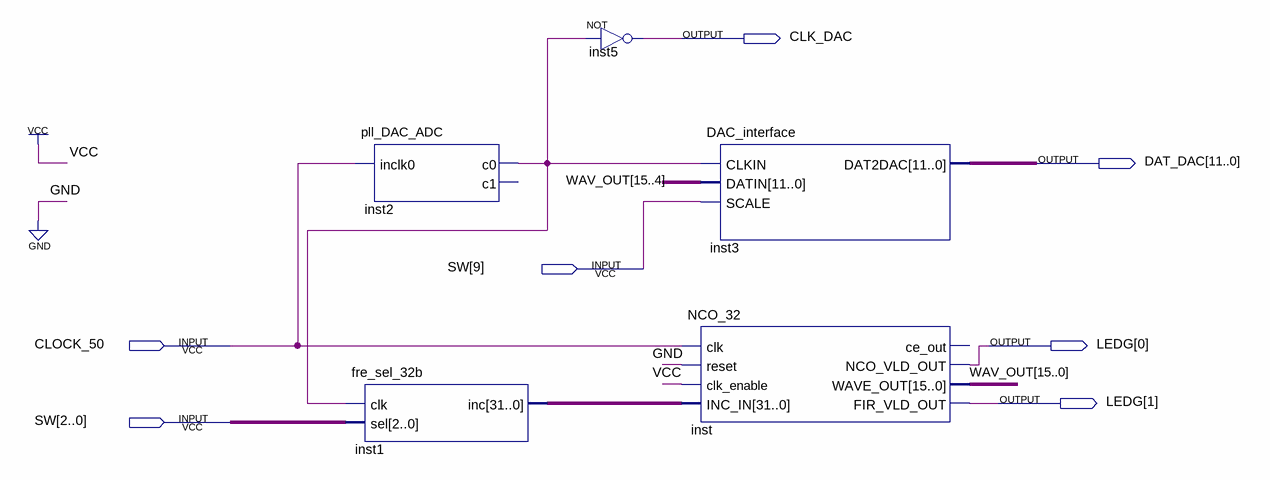
[diagram p0: schematic sheet]
// Quartus schematic NCO_32_quartus.bdf as structural Verilog: 5 symbols, 7 pins
module NCO_32_quartus (
  input  [9:0] SW,
  input  CLOCK_50,
  output CLK_DAC,
  output [11:0] DAT_DAC,
  output [1:0] LEDG
);

  wire inst2_c0;
  wire [15:0] WAV_OUT;
  wire [31:0] inst1_inc;

  pll_DAC_ADC inst2 (.inclk0(CLOCK_50), .c0(inst2_c0));  // open: c1
  fre_sel_32b inst1 (.clk(inst2_c0), .sel(SW[2:0]), .inc(inst1_inc));
  not inst5 (CLK_DAC, inst2_c0);
  DAC_interface inst3 (.CLKIN(inst2_c0), .DATIN(WAV_OUT[15:4]), .SCALE(SW[9]), .DAT2DAC(DAT_DAC));
  NCO_32 inst (
    .clk(CLOCK_50), .reset(1'b0), .clk_enable(1'b1), .INC_IN(inst1_inc), .NCO_VLD_OUT(LEDG[0]),
    .WAVE_OUT(WAV_OUT), .FIR_VLD_OUT(LEDG[1]));  // open: ce_out
endmodule
